# EAGLE schematic DIY Shield (EAGLE 6.2)
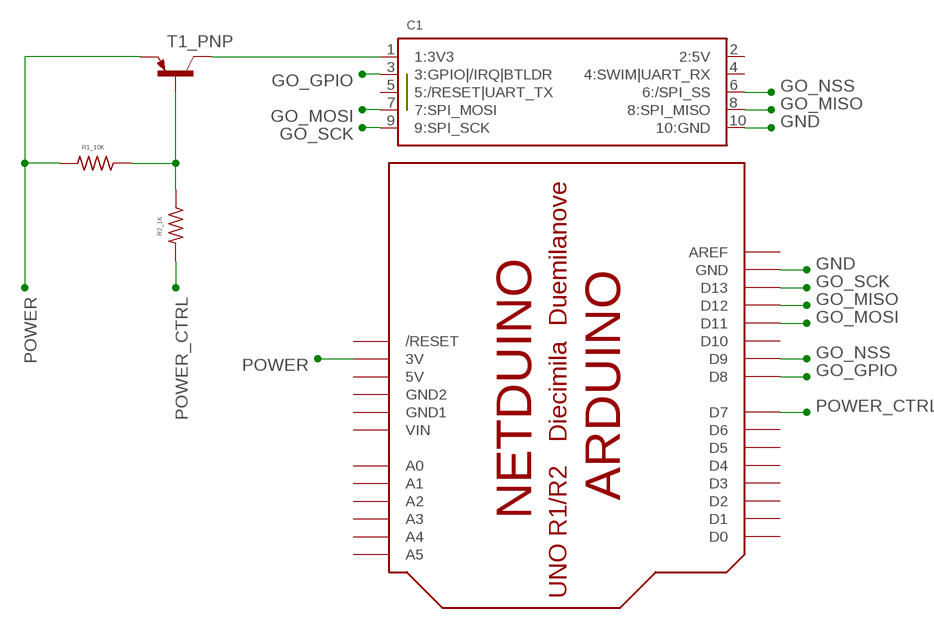
[diagram p0: schematic, sheet 1]

## Parts
C1  GO_CONNECTOR  [FCI-1.27X1.27MM_10PIN_HEADER_SHROUDED_SMT]
NETDUINOSHIELD  ARDUINOUNO  [ARDUINO]
R1_10K  RESISTOR_0805  [0805_NO_POLARITY]
R2_1K  RESISTOR_0805  [0805_NO_POLARITY]
T1_PNP  -PNP-TO92  [TO92]

## Nets
GND: C1.10(10:GND) NETDUINOSHIELD.GND
GO_GPIO: C1.3(3:GPIO|/IRQ|BTLDR) NETDUINOSHIELD.D8
GO_MISO: C1.8(8:SPI_MISO) NETDUINOSHIELD.D12
GO_MOSI: C1.7(7:SPI_MOSI) NETDUINOSHIELD.D11
GO_NSS: C1.6(6:/SPI_SS) NETDUINOSHIELD.D9
GO_SCK: C1.9(9:SPI_SCK) NETDUINOSHIELD.D13
N$1: C1.1(1:3V3) T1_PNP.3(C)
N$2: R1_10K.1 R2_1K.1 T1_PNP.2(B)
POWER: NETDUINOSHIELD.3V R1_10K.2 T1_PNP.1(E)
POWER_CTRL: NETDUINOSHIELD.D7 R2_1K.2
Unconnected: C1.4(4:SWIM|UART_RX) C1.5(5:/RESET|UART_TX) NETDUINOSHIELD.A0 NETDUINOSHIELD.A1 NETDUINOSHIELD.A2 NETDUINOSHIELD.A3 NETDUINOSHIELD.A4 NETDUINOSHIELD.A5 NETDUINOSHIELD.AREF NETDUINOSHIELD.D0 NETDUINOSHIELD.D1 NETDUINOSHIELD.D2 NETDUINOSHIELD.D3 NETDUINOSHIELD.D4 NETDUINOSHIELD.D5 NETDUINOSHIELD.D6 NETDUINOSHIELD.D10 NETDUINOSHIELD.RESET(/RESET)

## Notes on the sheet
- NETDUINO

## Power pins joined to a net without a drawn wire
2:5V: C1.2(2:5V)
5V: NETDUINOSHIELD.5V
GND1: NETDUINOSHIELD.GND1
GND2: NETDUINOSHIELD.GND2
VIN: NETDUINOSHIELD.VIN

## Library data of the parts
C1 = Nwazet.Go:GO_CONNECTOR
NETDUINOSHIELD = adafruit:ARDUINO: Arduino Diecimila/Duemilanove Make a shield with ease, this package has all the named pins as well as the two mounting drill holes and an outline of the USB and DC power connector. The outline is on the DIMENSION layer, so if your board house uses it they will cut the outline to match. http://www.ladyada.net/library/pcb/eaglelibrary.html
R1_10K R2_1K = Nwazet.Go:RESISTOR_0805
T1_PNP = transistor:*-PNP-: PNP Transistror